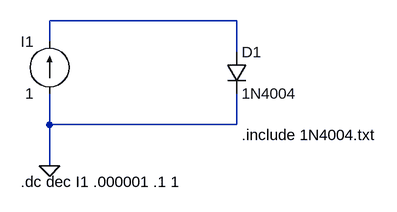
[diagram p0: schematic Lab1Pre.asc]
Lab1Pre.asc, the LTspice schematic file:
Version 4
SHEET 1 880 680
WIRE 256 80 -32 80
WIRE -32 112 -32 80
WIRE 256 128 256 80
WIRE -32 240 -32 192
WIRE 256 240 256 192
WIRE 256 240 -32 240
WIRE -32 304 -32 240
FLAG -32 304 0
SYMBOL diode 240 128 R0
SYMATTR InstName D1
SYMATTR Value 1N4004
SYMBOL current -32 192 R180
WINDOW 0 24 80 Left 2
WINDOW 3 24 0 Left 2
WINDOW 123 0 0 Left 2
WINDOW 39 0 0 Left 2
SYMATTR InstName I1
SYMATTR Value 1
TEXT 264 256 Left 2 !.include 1N4004.txt
TEXT -76 328 Left 2 !.dc dec I1 .000001 .1 1

The netlist it stands for:
* Lab1Pre.asc
D1 N001 0 1N4004
I1 0 N001 1
.model D D
.lib standard.dio
.include 1N4004.txt
.dc dec I1 .000001 .1 1
.backanno
.end